# EAGLE schematic flash_mem (EAGLE 8.4.3)
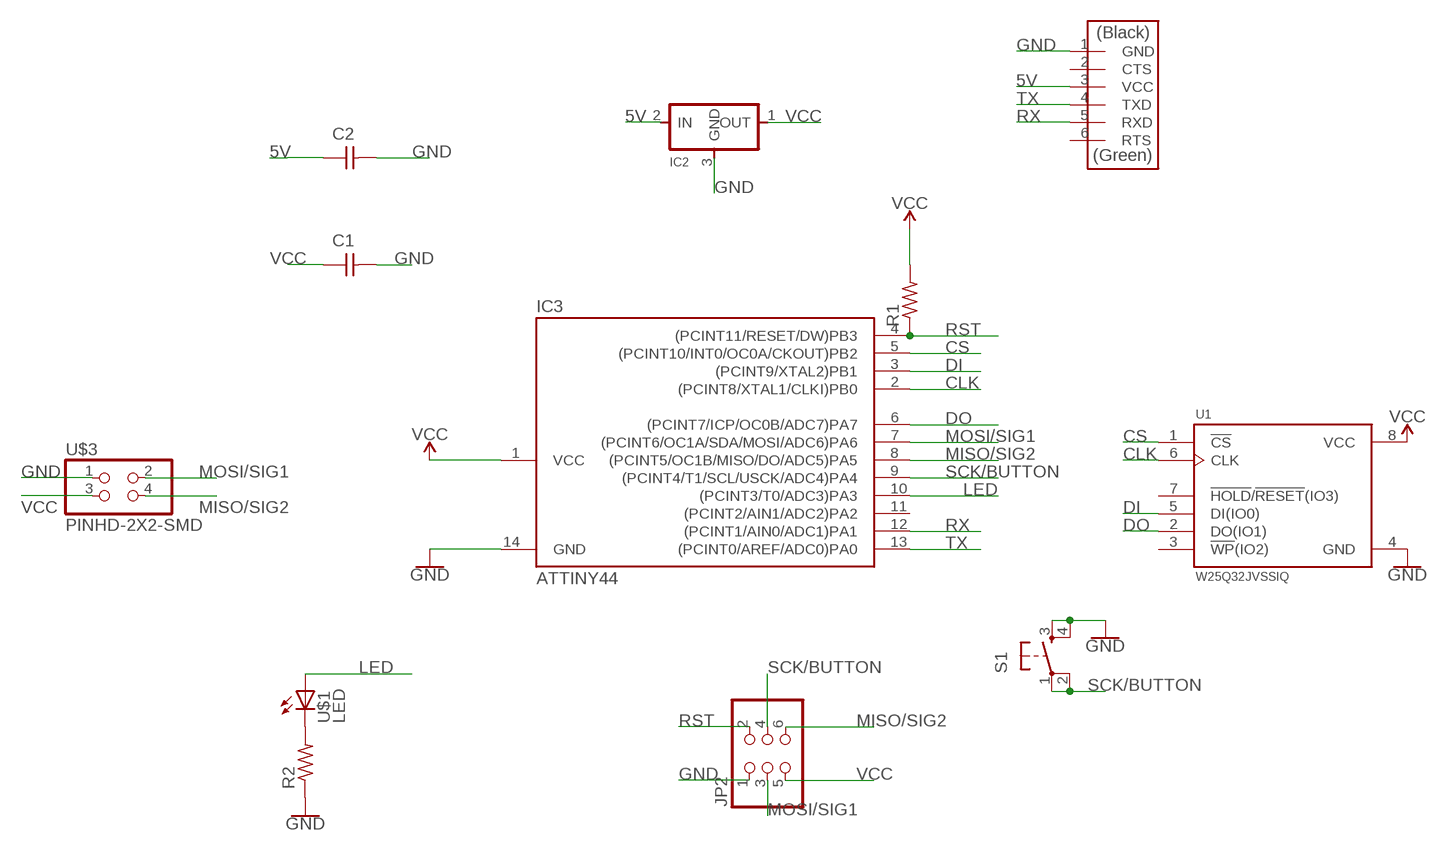
[diagram p0: schematic, sheet 1]

## Parts
C1  CAP-UNPOLARIZED  [C1206]
C2  CAP-UNPOLARIZED  [C1206]
IC2  REGULATORSOT23  [SOT23]
IC3  ATTINY44  [SOIC14_MOD]
JP2  PINHD-2X3-SMD  [2X03SMD]
R1  RES-US1206  [R1206]
R2  RES-US1206  [R1206]
S1  6MM_SWITCH6MM_SWITCH  [6MM_SWITCH]
U1  W25Q32JVSSIQ  [SOIC127P790X216-8N]
U$1  LED  [LED1206]
U$2  FTDI-SMD-HEADER  [1X06SMD]
U$3  PINHD-2X2-SMD  [2X02SMD]

## Nets
5V: C2.1 IC2.2(IN) U$2.3(VCC)
CLK: IC3.2((PCINT8/XTAL1/CLKI)PB0) U1.6(CLK)
CS: IC3.5((PCINT10/INT0/OC0A/CKOUT)PB2) U1.1(!CS)
DI: IC3.3((PCINT9/XTAL2)PB1) U1.5(DI(IO0))
DO: IC3.6((PCINT7/ICP/OC0B/ADC7)PA7) U1.2(DO(IO1))
GND: C1.2 C2.2 IC2.3(GND) IC3.14(GND) JP2.1 R2.1 S1.3(S) S1.4(S1) U1.4(GND) U$2.1(GND) U$3.1
LED: IC3.10((PCINT3/T0/ADC3)PA3) U$1.1(A)
MISO/SIG2: IC3.8((PCINT5/OC1B/MISO/DO/ADC5)PA5) JP2.6 U$3.4
MOSI/SIG1: IC3.7((PCINT6/OC1A/SDA/MOSI/ADC6)PA6) JP2.3 U$3.2
N$1: R2.2 U$1.2(C)
RST: IC3.4((PCINT11/RESET/DW)PB3) JP2.2 R1.1
RX: IC3.12((PCINT1/AIN0/ADC1)PA1) U$2.5(RXD)
SCK/BUTTON: IC3.9((PCINT4/T1/SCL/USCK/ADC4)PA4) JP2.4 S1.1(P) S1.2(P1)
TX: IC3.13((PCINT0/AREF/ADC0)PA0) U$2.4(TXD)
VCC: C1.1 IC2.1(OUT) IC3.1(VCC) JP2.5 R1.2 U1.8(VCC) U$3.3
Unconnected: IC3.11((PCINT2/AIN1/ADC2)PA2) U1.3(!WP!(IO2)) U1.7(!HOLD!/!RESET!(IO3)) U$2.2(CTS) U$2.6(RTS)

## Library data of the parts
C1 C2 = fab :CAP-UNPOLARIZED
IC2 = fab :REGULATOR
IC3 = fab :ATTINY44
JP2 = fab :PINHD-2X3-SMD: PIN HEADER
R1 R2 = fab :RES-US: Resistor (US Symbol) Variants with postfix FAB are widened to allow the routing of internal traces
S1 = fab :6MM_SWITCH: OMRON SWITCH
U1 = W25Q32JVSSIQ:W25Q32JVSSIQ: NOR Flash Serial-SPI 3V/3.3V 32M-bit 4M x 8 8.5ns 8-Pin SOIC; AVAILABILITY: Good; DESCRIPTION: NOR Flash Serial-SPI 3V 32Mbit 32M x 1bit 8-Pin SOIC; MF: Winbond; MP: W25Q32JVSSIQ; PACKAGE: SOIC-8 Winbond; PRICE: 0.44 USD
U$1 = fab :LED: LED
U$2 = fab :FTDI-SMD-HEADER
U$3 = fab :PINHD-2X2-SMD